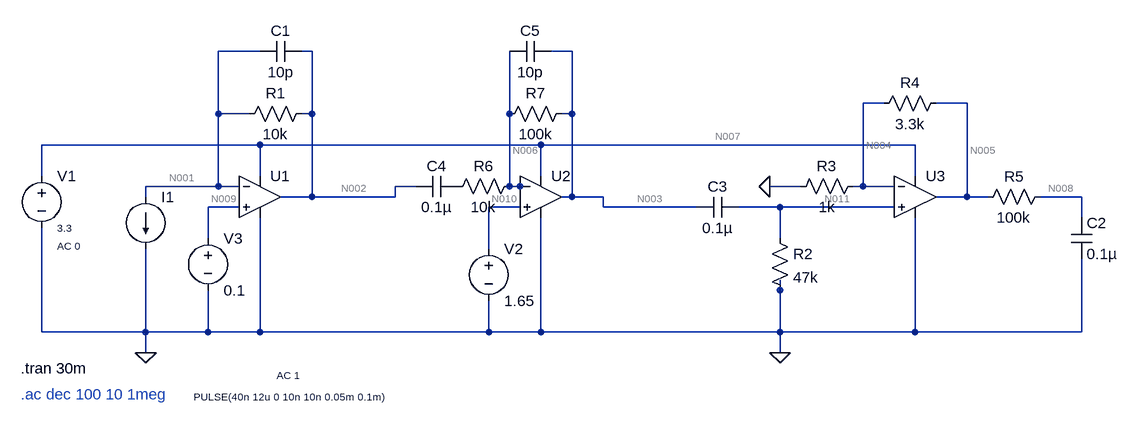
[diagram p0: schematic tia_sensor.asc]
tia_sensor.asc, the LTspice schematic file:
Version 4
SHEET 1 1536 680
WIRE 208 -32 144 -32
WIRE 288 -32 272 -32
WIRE 688 -32 656 -32
WIRE 1168 48 1136 48
WIRE 1296 48 1248 48
WIRE 144 64 144 -32
WIRE 192 64 144 64
WIRE 288 64 288 -32
WIRE 288 64 272 64
WIRE 592 64 592 -32
WIRE 688 64 688 -32
WIRE 688 64 672 64
WIRE 208 112 -128 112
WIRE 640 112 208 112
WIRE 1216 112 640 112
WIRE -128 160 -128 112
WIRE 208 160 208 112
WIRE 640 160 640 112
WIRE 1216 160 1216 112
WIRE 144 176 144 64
WIRE 144 176 32 176
WIRE 176 176 144 176
WIRE 448 176 416 176
WIRE 592 176 592 64
WIRE 608 176 592 176
WIRE 624 176 608 176
WIRE 1040 176 992 176
WIRE 1136 176 1136 48
WIRE 1136 176 1120 176
WIRE 1184 176 1136 176
WIRE 32 192 32 176
WIRE 288 192 288 64
WIRE 288 192 240 192
WIRE 416 192 416 176
WIRE 416 192 288 192
WIRE 688 192 688 64
WIRE 688 192 672 192
WIRE 736 192 688 192
WIRE 1296 192 1296 48
WIRE 1296 192 1248 192
WIRE 1328 192 1296 192
WIRE 1472 192 1408 192
WIRE 176 208 128 208
WIRE 608 208 560 208
WIRE 736 208 736 192
WIRE 880 208 736 208
WIRE 1008 208 944 208
WIRE 1184 208 1008 208
WIRE 1472 224 1472 192
WIRE 128 256 128 208
WIRE 1008 256 1008 208
WIRE 560 272 560 208
WIRE 1008 336 1008 320
WIRE -128 400 -128 240
WIRE 32 400 32 272
WIRE 32 400 -128 400
WIRE 128 400 128 336
WIRE 128 400 32 400
WIRE 208 400 208 224
WIRE 208 400 128 400
WIRE 560 400 560 352
WIRE 560 400 208 400
WIRE 640 400 640 224
WIRE 640 400 560 400
WIRE 1008 400 1008 336
WIRE 1008 400 640 400
WIRE 1216 400 1216 224
WIRE 1216 400 1008 400
WIRE 1472 400 1472 288
WIRE 1472 400 1216 400
WIRE 32 432 32 400
WIRE 1008 432 1008 400
FLAG 32 432 0
FLAG 1008 432 0
FLAG 992 176 0
SYMBOL res 288 48 R90
WINDOW 0 0 56 VBottom 2
WINDOW 3 32 56 VTop 2
SYMATTR InstName R1
SYMATTR Value 10k
SYMBOL voltage -128 144 R0
WINDOW 3 24 96 Left 1
WINDOW 123 24 124 Left 1
WINDOW 39 0 0 Left 0
SYMATTR Value 3.3
SYMATTR Value2 AC 0
SYMATTR InstName V1
SYMBOL current 32 192 R0
WINDOW 3 74 308 Left 1
WINDOW 123 202 275 Left 1
WINDOW 39 0 0 Left 0
SYMATTR Value PULSE(40n 12u 0 10n 10n 0.05m 0.1m)
SYMATTR Value2 AC 1
SYMATTR InstName I1
SYMBOL cap 272 -48 R90
WINDOW 0 0 32 VBottom 2
WINDOW 3 32 32 VTop 2
SYMATTR InstName C1
SYMATTR Value 10p
SYMBOL res 1136 160 R90
WINDOW 0 0 56 VBottom 2
WINDOW 3 32 56 VTop 2
SYMATTR InstName R3
SYMATTR Value 1k
SYMBOL res 1264 32 R90
WINDOW 0 0 56 VBottom 2
WINDOW 3 32 56 VTop 2
SYMATTR InstName R4
SYMATTR Value 3.3k
SYMBOL cap 512 160 R90
WINDOW 0 0 32 VBottom 2
WINDOW 3 32 32 VTop 2
SYMATTR InstName C4
SYMATTR Value 0.1µ
SYMBOL res 608 160 R90
WINDOW 0 0 56 VBottom 2
WINDOW 3 32 56 VTop 2
SYMATTR InstName R6
SYMATTR Value 10k
SYMBOL res 688 48 R90
WINDOW 0 0 56 VBottom 2
WINDOW 3 32 56 VTop 2
SYMATTR InstName R7
SYMATTR Value 100k
SYMBOL cap 656 -48 R90
WINDOW 0 0 32 VBottom 2
WINDOW 3 32 32 VTop 2
SYMATTR InstName C5
SYMATTR Value 10p
SYMBOL voltage 560 256 R0
WINDOW 123 0 0 Left 0
WINDOW 39 0 0 Left 0
SYMATTR InstName V2
SYMATTR Value 1.65
SYMBOL voltage 128 240 R0
WINDOW 123 0 0 Left 0
WINDOW 39 0 0 Left 0
SYMATTR InstName V3
SYMATTR Value 0.1
SYMBOL res 1424 176 R90
WINDOW 0 0 56 VBottom 2
WINDOW 3 32 56 VTop 2
SYMATTR InstName R5
SYMATTR Value 100k
SYMBOL cap 1456 224 R0
SYMATTR InstName C2
SYMATTR Value 0.1µ
SYMBOL res 992 240 R0
SYMATTR InstName R2
SYMATTR Value 47k
SYMBOL cap 944 192 R90
WINDOW 0 0 32 VBottom 2
WINDOW 3 32 32 VTop 2
SYMATTR InstName C3
SYMATTR Value 0.1µ
SYMBOL OpAmps\\UniversalOpAmp2 208 192 R0
SYMATTR InstName U1
SYMBOL OpAmps\\UniversalOpAmp2 640 192 R0
SYMATTR InstName U2
SYMBOL OpAmps\\UniversalOpAmp2 1216 192 R0
SYMATTR InstName U3
TEXT -160 456 Left 2 !.tran 30m
TEXT -160 496 Left 2 ;.ac dec 100 10 1meg

The netlist it stands for:
* tia_sensor.asc
R1 N002 N001 10k
V1 N007 0 3.3 AC 0
I1 N001 0 PULSE(40n 12u 0 10n 10n 0.05m 0.1m) AC 1
C1 N002 N001 10p
R3 N004 0 1k
R4 N005 N004 3.3k
C4 P001 N002 0.1µ
R6 N006 P001 10k
R7 N003 N006 100k
C5 N003 N006 10p
V2 N010 0 1.65
V3 N009 0 0.1
R5 N008 N005 100k
C2 N008 0 0.1µ
R2 N011 0 47k
C3 N011 N003 0.1µ
XU1 N009 N001 N007 0 N002 level2 Avol=1Meg GBW=10Meg Slew=10Meg Ilimit=25m Rail=0 Vos=0 En=0 Enk=0 In=0 Ink=0 Rin=500Meg  ; pins In+ In- V+ V- OUT
XU2 N010 N006 N007 0 N003 level2 Avol=1Meg GBW=10Meg Slew=10Meg Ilimit=25m Rail=0 Vos=0 En=0 Enk=0 In=0 Ink=0 Rin=500Meg  ; pins In+ In- V+ V- OUT
XU3 N011 N004 N007 0 N005 level2 Avol=1Meg GBW=10Meg Slew=10Meg Ilimit=25m Rail=0 Vos=0 En=0 Enk=0 In=0 Ink=0 Rin=500Meg  ; pins In+ In- V+ V- OUT
.tran 30m
* .ac dec 100 10 1meg
.lib UniversalOpAmp2.lib
.backanno
.end

* Results of the author's LTspice run, read from the files saved beside the schematic
* Operating Point, zero values left out:
*   V(n002) = 100.4 mV
*   V(n001) = 100 mV
*   V(n007) = 3.3 V
*   V(n004) = 176.5 µV
*   V(n005) = 748 µV
*   V(p001) = 1.65 V
*   V(n006) = 1.65 V
*   V(n003) = 1.65 V
*   V(n010) = 1.65 V
*   V(n009) = 100 mV
*   V(n008) = 748 µV
*   V(n011) = 155.1 µV
*   I(I1) = 40 nA
*   I(R1) = 36.9 nA
*   I(R3) = 176.5 nA
*   I(R4) = 173.2 nA
*   I(R2) = 3.3 nA
*   I(V1) = -226.8 µA
*   I(V3) = 3.1 nA
*   Ix(u1:1) = -3.1 nA
*   Ix(u1:2) = -3.1 nA
*   Ix(u1:3) = 56.71 µA
*   Ix(u1:4) = -56.65 µA
*   Ix(u1:5) = -36.9 nA
*   Ix(u2:3) = 165 µA
*   Ix(u2:4) = -165 µA
*   Ix(u3:1) = -3.3 nA
*   Ix(u3:2) = -3.3 nA
*   Ix(u3:3) = 5.079 µA
*   Ix(u3:4) = -4.881 µA
*   Ix(u3:5) = -173.2 nA